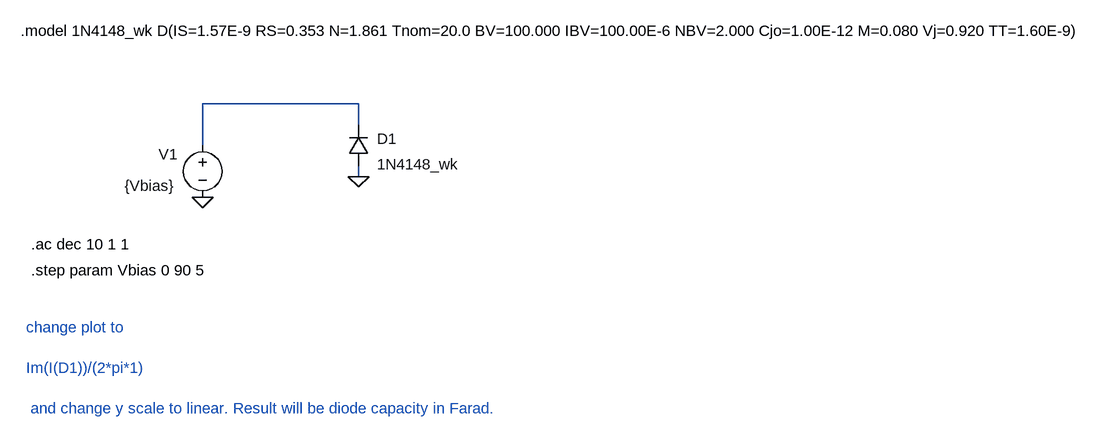
[diagram p0: schematic diode_capacity.asc]
diode_capacity.asc, the LTspice schematic file:
Version 4
SHEET 1 1544 680
WIRE 256 48 16 48
WIRE 256 80 256 48
WIRE 16 112 16 48
WIRE 256 160 256 144
FLAG 16 192 0
FLAG 256 160 0
SYMBOL diode 272 144 R180
WINDOW 0 -43 42 Left 2
WINDOW 3 -140 3 Left 2
SYMATTR InstName D1
SYMATTR Value 1N4148_wk
SYMBOL voltage 16 96 R0
WINDOW 0 -68 30 Left 2
WINDOW 3 -120 78 Left 2
WINDOW 39 0 0 Left 0
SYMATTR InstName V1
SYMATTR Value {Vbias}
SYMATTR Value2 AC 1
TEXT -264 -64 Left 2 !.model 1N4148_wk D(IS=1.57E-9 RS=0.353 N=1.861 Tnom=20.0 BV=100.000 IBV=100.00E-6 NBV=2.000 Cjo=1.00E-12 M=0.080 Vj=0.920 TT=1.60E-9)
TEXT -248 264 Left 2 !.ac dec 10 1 1
TEXT -248 304 Left 2 !.step param Vbias 0 90 5
TEXT -256 392 Left 2 ;change plot to\n \nIm(I(D1))/(2*pi*1)\n \n and change y scale to linear. Result will be diode capacity in Farad.

The netlist it stands for:
* diode_capacity.asc
D1 0 N001 1N4148_wk
V1 N001 0 {Vbias} AC 1
.model D D
.lib standard.dio
.model 1N4148_wk D(IS=1.57E-9 RS=0.353 N=1.861 Tnom=20.0 BV=100.000 IBV=100.00E-6 NBV=2.000 Cjo=1.00E-12 M=0.080 Vj=0.920 TT=1.60E-9)
.ac dec 10 1 1
.step param Vbias 0 90 5
* change plot to
* Im(I(D1))/(2*pi*1)
*  and change y scale to linear. Result will be diode capacity in Farad.
.backanno
.end